# Altium schematic sheet Microprocessor1.SchDoc
size B; Organization: The Pennsylvania State University - Applied Research Laboratory; DocumentNumber: 9; SheetNumber: 9; SheetTotal: 14; PageSetup: Record=PageOptions|CenterHorizontal=True|CenterVertical=True|PrintScale=0.99|XCorrection=1.00|YCorrection=1.00|PrintKind=1|BorderSize=5000000|LeftOffset=0|BottomOffset=0|Orientation=2|PaperLength=1000|PaperWidth=1000|Scale=100|PaperSource=7|PrintQuality=-4|MediaType=1|DitherType=10|PaperKind=Tabloid (11 x 17")|PrintScaleMode=1; SCHEMATIC_SHEET_TITLE: LPC4357 P0-PA; PAGE_TITLE: -
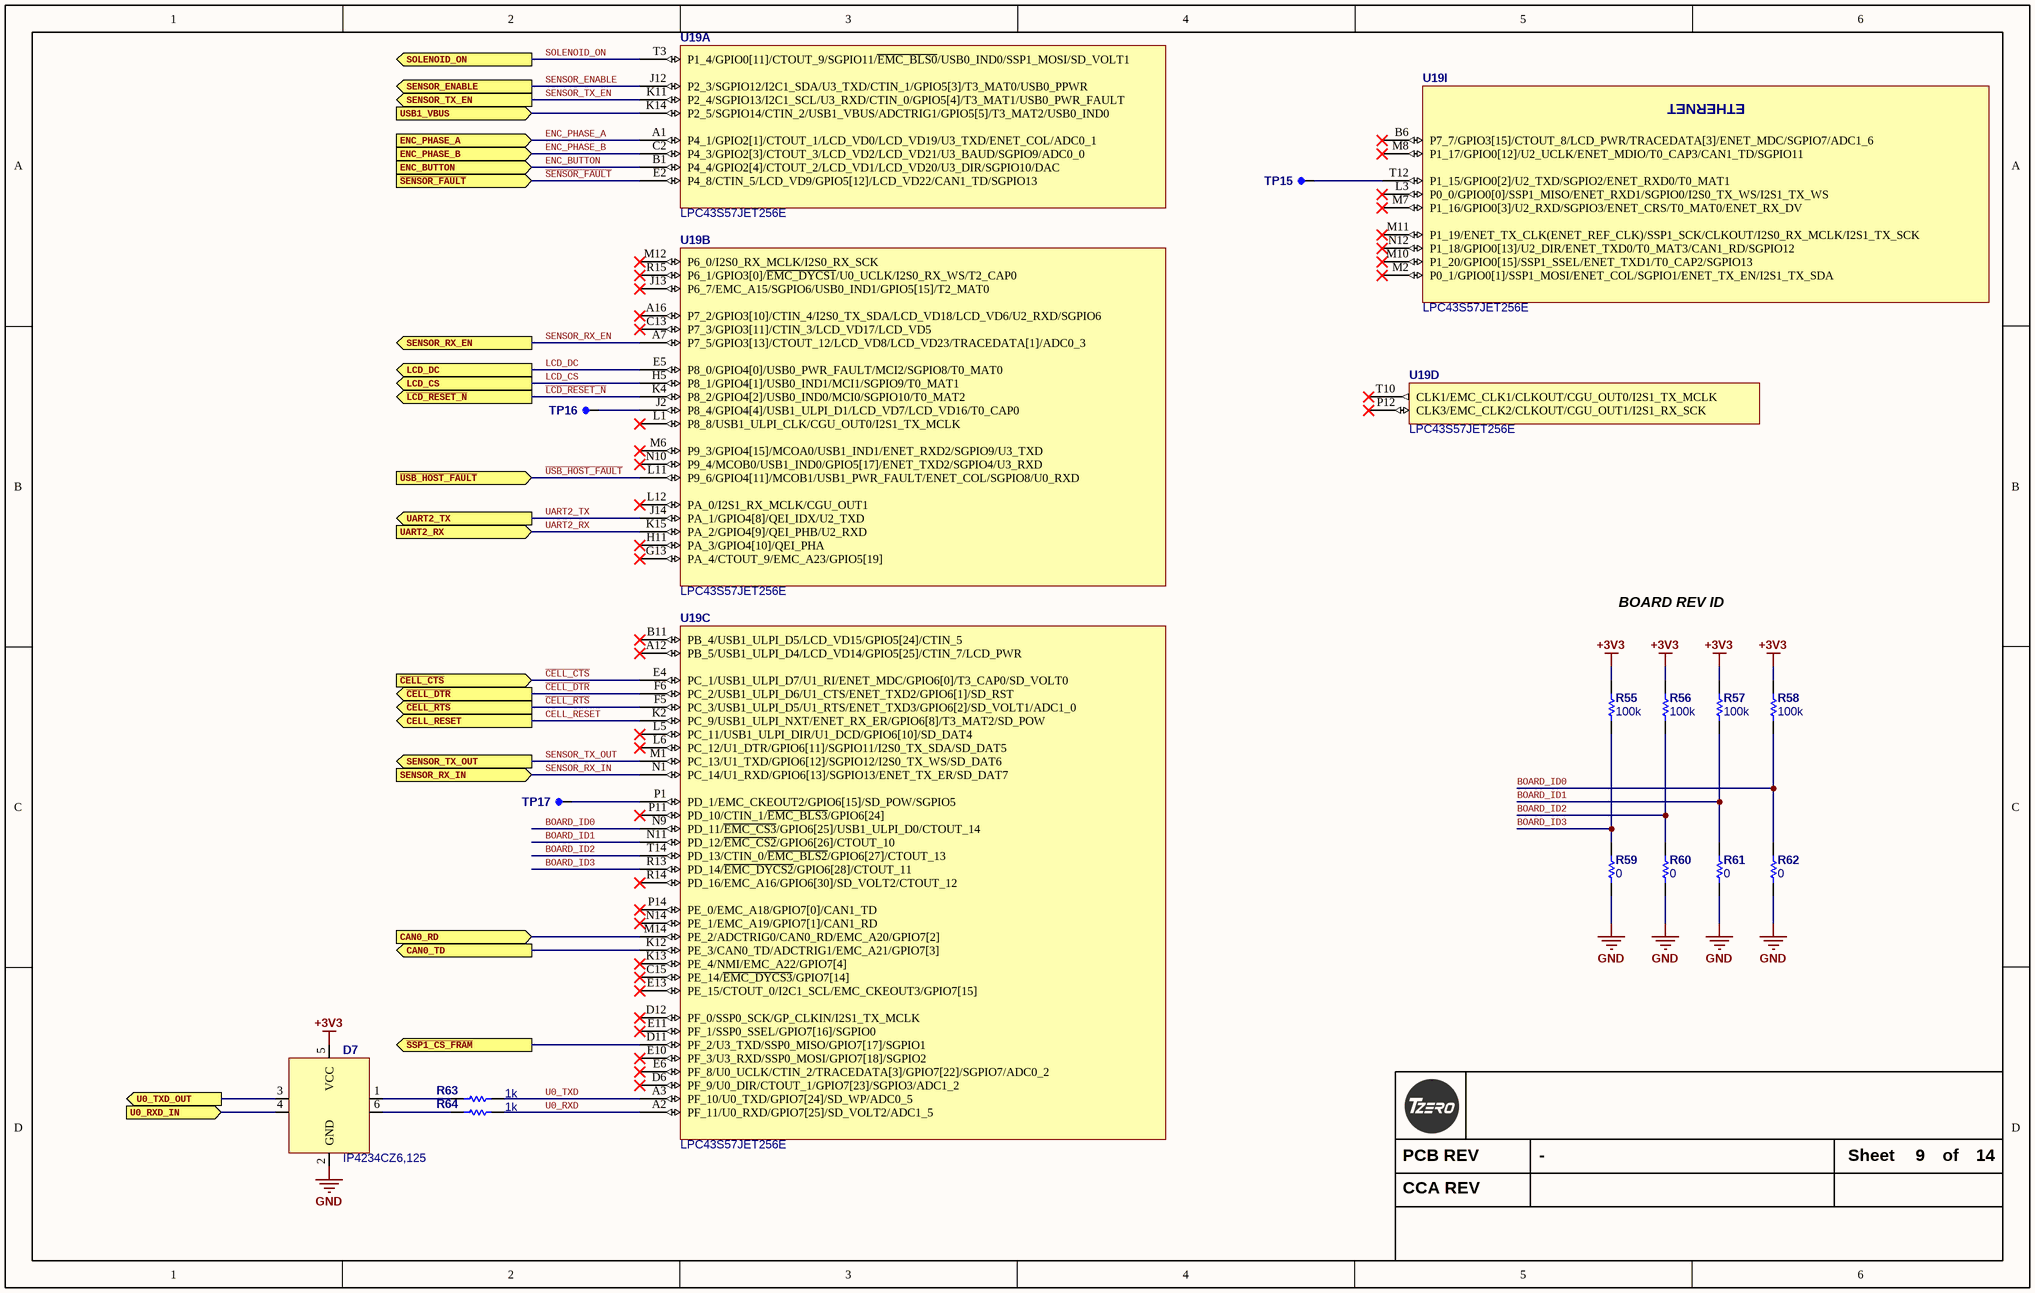
[diagram p0: Microprocessor1.SchDoc]

## Parts
D7  IP4234CZ6,125  [SOT427_MEDIUM]
R55  100k  [R0603_0.55MM_MD]
R56  100k  [R0603_0.55MM_MD]
R57  100k  [R0603_0.55MM_MD]
R58  100k  [R0603_0.55MM_MD]
R59  0  [R0603_0.55MM_MD]
R60  0  [R0603_0.55MM_MD]
R61  0  [R0603_0.55MM_MD]
R62  0  [R0603_0.55MM_MD]
R63  1k  [R0603_0.55MM_MD]
R64  1k  [R0603_0.55MM_MD]
TP15  (no value)  [TP_SMT_25_MIL_ROUND]  (net tie, no BOM)
TP16  (no value)  [TP_SMT_25_MIL_ROUND]  (net tie, no BOM)
TP17  (no value)  [TP_SMT_25_MIL_ROUND]  (net tie, no BOM)
U19  LPC43S57JET256E  [LBGA256 16X16 1700X1700X155]  (parts A,B,C,D,I of 10)

## Ports
CAN0_RD (in), CAN0_TD (out), CELL_RESET (out), ENC_BUTTON (in), ENC_PHASE_A (in), ENC_PHASE_B (in), LCD_CS (out), LCD_DC (out), SENSOR_ENABLE (out), SENSOR_RX_EN (out), SENSOR_RX_IN (in), SENSOR_TX_EN (out), SENSOR_TX_OUT (out), SOLENOID_ON (out), U0_RXD_IN (in), U0_TXD_OUT (out), UART2_RX (in), UART2_TX (out), USB1_VBUS (in), ~{CELL_CTS} (in), ~{CELL_DTR} (out), ~{CELL_RTS} (out), ~{LCD_RESET_N} (out), ~{SENSOR_FAULT} (in), ~{SSP1_CS_FRAM} (out), ~{USB_HOST_FAULT} (in)

## Nets
+3V3: D7.5(VCC) R55.1 R56.1 R57.1 R58.1
GND: D7.2(GND) R59.2 R60.2 R61.2 R62.2
~{CELL_CTS}: U19.E4(PC_1/USB1_ULPI_D7/U1_RI/ENET_MDC/GPIO6[0]/T3_CAP0/SD_VOLT0) ; port ~{CELL_CTS}
~{CELL_DTR}: U19.F6(PC_2/USB1_ULPI_D6/U1_CTS/ENET_TXD2/GPIO6[1]/SD_RST) ; port ~{CELL_DTR}
~{CELL_RTS}: U19.F5(PC_3/USB1_ULPI_D5/U1_RTS/ENET_TXD3/GPIO6[2]/SD_VOLT1/ADC1_0) ; port ~{CELL_RTS}
~{LCD_RESET_N}: U19.K4(P8_2/GPIO4[2]/USB0_IND0/MCI0/SGPIO10/T0_MAT2) ; port ~{LCD_RESET_N}
~{SENSOR_FAULT}: U19.E2(P4_8/CTIN_5/LCD_VD9/GPIO5[12]/LCD_VD22/CAN1_TD/SGPIO13) ; port ~{SENSOR_FAULT}
~{SSP1_CS_FRAM}: U19.D11(PF_2/U3_TXD/SSP0_MISO/GPIO7[17]/SGPIO1) ; port ~{SSP1_CS_FRAM}
~{USB_HOST_FAULT}: U19.L11(P9_6/GPIO4[11]/MCOB1/USB1_PWR_FAULT/ENET_COL/SGPIO8/U0_RXD) ; port ~{USB_HOST_FAULT}
BOARD_ID0: R58.2 R62.1 U19.N9(PD_11/~{EMC_CS3}/GPIO6[25]/USB1_ULPI_D0/CTOUT_14)
BOARD_ID1: R57.2 R61.1 U19.N11(PD_12/~{EMC_CS2}/GPIO6[26]/CTOUT_10)
BOARD_ID2: R56.2 R60.1 U19.T14(PD_13/CTIN_0/~{EMC_BLS2}/GPIO6[27]/CTOUT_13)
BOARD_ID3: R55.2 R59.1 U19.R13(PD_14/~{EMC_DYCS2}/GPIO6[28]/CTOUT_11)
CAN0_RD: U19.M14(PE_2/ADCTRIG0/CAN0_RD/EMC_A20/GPIO7[2]) ; port CAN0_RD
CAN0_TD: U19.K12(PE_3/CAN0_TD/ADCTRIG1/EMC_A21/GPIO7[3]) ; port CAN0_TD
CELL_RESET: U19.K2(PC_9/USB1_ULPI_NXT/ENET_RX_ER/GPIO6[8]/T3_MAT2/SD_POW) ; port CELL_RESET
ENC_BUTTON: U19.B1(P4_4/GPIO2[4]/CTOUT_2/LCD_VD1/LCD_VD20/U3_DIR/SGPIO10/DAC) ; port ENC_BUTTON
ENC_PHASE_A: U19.A1(P4_1/GPIO2[1]/CTOUT_1/LCD_VD0/LCD_VD19/U3_TXD/ENET_COL/ADC0_1) ; port ENC_PHASE_A
ENC_PHASE_B: U19.C2(P4_3/GPIO2[3]/CTOUT_3/LCD_VD2/LCD_VD21/U3_BAUD/SGPIO9/ADC0_0) ; port ENC_PHASE_B
LCD_CS: U19.H5(P8_1/GPIO4[1]/USB0_IND1/MCI1/SGPIO9/T0_MAT1) ; port LCD_CS
LCD_DC: U19.E5(P8_0/GPIO4[0]/USB0_PWR_FAULT/MCI2/SGPIO8/T0_MAT0) ; port LCD_DC
SENSOR_ENABLE: U19.J12(P2_3/SGPIO12/I2C1_SDA/U3_TXD/CTIN_1/GPIO5[3]/T3_MAT0/USB0_PPWR) ; port SENSOR_ENABLE
SENSOR_RX_EN: U19.A7(P7_5/GPIO3[13]/CTOUT_12/LCD_VD8/LCD_VD23/TRACEDATA[1]/ADC0_3) ; port SENSOR_RX_EN
SENSOR_RX_IN: U19.N1(PC_14/U1_RXD/GPIO6[13]/SGPIO13/ENET_TX_ER/SD_DAT7) ; port SENSOR_RX_IN
SENSOR_TX_EN: U19.K11(P2_4/SGPIO13/I2C1_SCL/U3_RXD/CTIN_0/GPIO5[4]/T3_MAT1/USB0_PWR_FAULT) ; port SENSOR_TX_EN
SENSOR_TX_OUT: U19.M1(PC_13/U1_TXD/GPIO6[12]/SGPIO12/I2S0_TX_WS/SD_DAT6) ; port SENSOR_TX_OUT
SOLENOID_ON: U19.T3(P1_4/GPIO0[11]/CTOUT_9/SGPIO11/~{EMC_BLS0}/USB0_IND0/SSP1_MOSI/SD_VOLT1) ; port SOLENOID_ON
U0_RXD: R64.2 U19.A2(PF_11/U0_RXD/GPIO7[25]/SD_VOLT2/ADC1_5)
U0_RXD_IN: D7.4 ; port U0_RXD_IN
U0_TXD: R63.2 U19.A3(PF_10/U0_TXD/GPIO7[24]/SD_WP/ADC0_5)
U0_TXD_OUT: D7.3 ; port U0_TXD_OUT
UART2_RX: U19.K15(PA_2/GPIO4[9]/QEI_PHB/U2_RXD) ; port UART2_RX
UART2_TX: U19.J14(PA_1/GPIO4[8]/QEI_IDX/U2_TXD) ; port UART2_TX
USB1_VBUS: U19.K14(P2_5/SGPIO14/CTIN_2/USB1_VBUS/ADCTRIG1/GPIO5[5]/T3_MAT2/USB0_IND0) ; port USB1_VBUS
NetD7_1: D7.1 R63.1
NetD7_6: D7.6 R64.1
NetTP15_1: TP15.1 U19.T12(P1_15/GPIO0[2]/U2_TXD/SGPIO2/ENET_RXD0/T0_MAT1)
NetTP16_1: TP16.1 U19.J2(P8_4/GPIO4[4]/USB1_ULPI_D1/LCD_VD7/LCD_VD16/T0_CAP0)
NetTP17_1: TP17.1 U19.P1(PD_1/EMC_CKEOUT2/GPIO6[15]/SD_POW/SGPIO5)

Not connected (* = marked no-connect by the designer): U19 A12(PB_5/USB1_ULPI_D4/LCD_VD14/GPIO5[25]/CTIN_7/LCD_PWR)* A16(P7_2/GPIO3[10]/CTIN_4/I2S0_TX_SDA/LCD_VD18/LCD_VD6/U2_RXD/SGPIO6)* B6(P7_7/GPIO3[15]/CTOUT_8/LCD_PWR/TRACEDATA[3]/ENET_MDC/SGPIO7/ADC1_6)* B11(PB_4/USB1_ULPI_D5/LCD_VD15/GPIO5[24]/CTIN_5)* C13(P7_3/GPIO3[11]/CTIN_3/LCD_VD17/LCD_VD5)* C15(PE_14/~{EMC_DYCS3}/GPIO7[14])* D6(PF_9/U0_DIR/CTOUT_1/GPIO7[23]/SGPIO3/ADC1_2)* D12(PF_0/SSP0_SCK/GP_CLKIN/I2S1_TX_MCLK)* E6(PF_8/U0_UCLK/CTIN_2/TRACEDATA[3]/GPIO7[22]/SGPIO7/ADC0_2)* E10(PF_3/U3_RXD/SSP0_MOSI/GPIO7[18]/SGPIO2)* E11(PF_1/SSP0_SSEL/GPIO7[16]/SGPIO0)* E13(PE_15/CTOUT_0/I2C1_SCL/EMC_CKEOUT3/GPIO7[15])* G13(PA_4/CTOUT_9/EMC_A23/GPIO5[19])* H11(PA_3/GPIO4[10]/QEI_PHA)* J13(P6_7/EMC_A15/SGPIO6/USB0_IND1/GPIO5[15]/T2_MAT0)* K13(PE_4/NMI/EMC_A22/GPIO7[4])* L1(P8_8/USB1_ULPI_CLK/CGU_OUT0/I2S1_TX_MCLK)* L3(P0_0/GPIO0[0]/SSP1_MISO/ENET_RXD1/SGPIO0/I2S0_TX_WS/I2S1_TX_WS)* L5(PC_11/USB1_ULPI_DIR/U1_DCD/GPIO6[10]/SD_DAT4)* L6(PC_12/U1_DTR/GPIO6[11]/SGPIO11/I2S0_TX_SDA/SD_DAT5)* L12(PA_0/I2S1_RX_MCLK/CGU_OUT1)* M2(P0_1/GPIO0[1]/SSP1_MOSI/ENET_COL/SGPIO1/ENET_TX_EN/I2S1_TX_SDA)* M6(P9_3/GPIO4[15]/MCOA0/USB1_IND1/ENET_RXD2/SGPIO9/U3_TXD)* M7(P1_16/GPIO0[3]/U2_RXD/SGPIO3/ENET_CRS/T0_MAT0/ENET_RX_DV)* M8(P1_17/GPIO0[12]/U2_UCLK/ENET_MDIO/T0_CAP3/CAN1_TD/SGPIO11)* M10(P1_20/GPIO0[15]/SSP1_SSEL/ENET_TXD1/T0_CAP2/SGPIO13)* M11(P1_19/ENET_TX_CLK(ENET_REF_CLK)/SSP1_SCK/CLKOUT/I2S0_RX_MCLK/I2S1_TX_SCK)* M12(P6_0/I2S0_RX_MCLK/I2S0_RX_SCK)* N10(P9_4/MCOB0/USB1_IND0/GPIO5[17]/ENET_TXD2/SGPIO4/U3_RXD)* N12(P1_18/GPIO0[13]/U2_DIR/ENET_TXD0/T0_MAT3/CAN1_RD/SGPIO12)* N14(PE_1/EMC_A19/GPIO7[1]/CAN1_RD)* P11(PD_10/CTIN_1/~{EMC_BLS3}/GPIO6[24])* P12(CLK3/EMC_CLK2/CLKOUT/CGU_OUT1/I2S1_RX_SCK)* P14(PE_0/EMC_A18/GPIO7[0]/CAN1_TD)* R14(PD_16/EMC_A16/GPIO6[30]/SD_VOLT2/CTOUT_12)* R15(P6_1/GPIO3[0]/~{EMC_DYCS1}/U0_UCLK/I2S0_RX_WS/T2_CAP0)* T10(CLK1/EMC_CLK1/CLKOUT/CGU_OUT0/I2S1_TX_MCLK)*

## Notes on the sheet
- BOARD REV ID
- PCB REV
- Sheet
- of
- CCA REV
- (in symbol LPC43S57JET256E, part I) ETHERNET

## Library data of the parts
D7 = IP4234CZ6,125: IC USB2.0 ESD PROTECTION SOT457; Manufacturer: NXP Semiconductors; CategorySort: 400; Voltage - Reverse Standoff (Typ): 3V; Voltage - Breakdown: 6V; Power (Watts): 100W; Polarization: 2 Channel Array - Bidirectional; Value: IP4234CZ6,125; Sort Value: *; Category: Diodes; Supplier 1: Digi-Key; Supplier Part Number 1: 568-5869-1-ND; Manufacturer Part Number: IP4234CZ6,125; RoHS: RoHS Compliant; Stock 1: 5142; Pricing 1: 1=0.52, 10=0.418, 25=0.3656, 100=0.3135, 250=0.27076, 500=0.23276, 1000=0.1805 (USD); Mounting Type: Surface Mount; Package: SC-74, SOT-457; Supplier Device Package: 6-TSOP; Packaging: Cut Tape (CT); ComponentLink1URL: http://www.nxp.com/documents/data_sheet/IP4234CZ6.pdf; ComponentLink1Description: http://www.nxp.com/documents/data_sheet/IP4234CZ6.pdf; Manufacturer 1: NXP Semiconductors; Manufacturer Part Number 1: IP4234CZ6,125
R55-R58 = ERJ-3EKF1003V: RES 100K OHM 1/10W 1% 0603 SMD; Manufacturer: Panasonic Electronic Components; Package Power: 0603  (0.1W); Power (Watts): 0.1W- 1/10W; Temperature Coefficient: ±100ppm/°C; Limiting Element Voltage: 75; Maximum Overload Voltage: 150; Maximum Working Voltage: 75.0V; Substitution Notes: 100k , ±1% , 0603 , AEC-Q200; Value: 100k; Manufacturer Part Number: ERJ-3EKF1003V; ComponentLink1Description: Internal Datasheet; ComponentLink1URL: datasheets\Panasonic Electronic Components\AOA0000CE2.pdf; ComponentLink2Description: External Datasheet; ComponentLink2URL: http://industrial.panasonic.com/www-data/pdf/AOA0000/AOA0000CE2.pdf; Supplier 1: Digi-Key; Supplier Part Number 1: P100KHCT-ND; Category: Resistors; Resistance (Ohms): 100k; Composition: Thick Film; Features: -; Tolerance: ±1%; Package: 0603 (1608 Metric); Supplier Package: 0603; Size / Dimension: 0.063" L x 0.031" W (1.60mm x 0.80mm); Height: 0.55MM; Number of Terminations: 2; Packaging: Cut Tape (CT); Sort Value: 100000; Sort Value Package: 603_100000; Ratings: AEC-Q200
R59-R62 = ERJ-3GEY0R00V: RES 0.0 OHM 1/10W JUMP 0603 SMD; Manufacturer: Panasonic Electronic Components; Power (Watts): 0.1W- 1/10W; Tolerance: Jumper; Package Power: 0603  (0.1W); Limiting Element Voltage: 75; Maximum Overload Voltage: 150; Maximum Working Voltage: 0.0V; Substitution Notes: 0 , Jumper , 0603 , AEC-Q200; Value: 0; Supplier 1: Digi-Key; Supplier Part Number 1: P0.0GCT-ND; Manufacturer Part Number: ERJ-3GEY0R00V; Category: Resistors; Sort Value: 0; Composition: Thick Film; Features: -; Temperature Coefficient: -; Package: 0603 (1608 Metric); Size / Dimension: 0.063" L x 0.031" W (1.60mm x 0.80mm); Height: 0.55MM; ComponentLink1URL: datasheets\Panasonic Electronic Components\AOA0000CE1.pdf; ComponentLink1Description: Internal Datasheet; ComponentLink2Description: External Datasheet; ComponentLink2URL: http://industrial.panasonic.com/www-data/pdf/AOA0000/AOA0000CE1.pdf; Resistance (Ohms): 0; Supplier Package: 0603; Number of Terminations: 2; Sort Value Package: 603_0; Ratings: AEC-Q200
R63 R64 = ERJ-3EKF1001V: RES 1K OHM 1/10W 1% 0603 SMD; Manufacturer: Panasonic Electronic Components; Package Power: 0603  (0.1W); Power (Watts): 0.1W- 1/10W; Temperature Coefficient: ±100ppm/°C; Limiting Element Voltage: 75; Maximum Overload Voltage: 150; Maximum Working Voltage: 10.0V; Substitution Notes: 1k , ±1% , 0603 , AEC-Q200; Value: 1k; Manufacturer Part Number: ERJ-3EKF1001V; ComponentLink1Description: Internal Datasheet; ComponentLink1URL: datasheets\Panasonic Electronic Components\AOA0000CE2.pdf; ComponentLink2Description: External Datasheet; ComponentLink2URL: http://industrial.panasonic.com/www-data/pdf/AOA0000/AOA0000CE2.pdf; Supplier 1: Digi-Key; Supplier Part Number 1: P1.00KHCT-ND; Category: Resistors; Resistance (Ohms): 1k; Composition: Thick Film; Features: -; Tolerance: ±1%; Package: 0603 (1608 Metric); Supplier Package: 0603; Size / Dimension: 0.063" L x 0.031" W (1.60mm x 0.80mm); Height: 0.55MM; Number of Terminations: 2; Packaging: Cut Tape (CT); Sort Value: 1000; Sort Value Package: 603_1000; Ratings: AEC-Q200
TP15-TP17 = TP SMT 25MIL: Sort Value: *; Category: *; CategorySort: *
U19 = LPC43S57JET256E: ARM Microcontrollers - MCU CortexM0/4 32bit 1MB Cortex-M4/M0; Manufacturer: NXP Semiconductors; CategorySort: 600; Data RAM Size: 136 KB; Core: ARM Cortex M4/M0; Maximum Clock Frequency: 204 MHz; On-Chip ADC: Yes; Operating Supply Voltage: 2.2 V to 3.6 V; Processor Series: LPC4357; Product Status: New Technology; Value: LPC43S57JET256E; Sort Value: *; Category: Integrated Circuits; Supplier 1: Digi-Key; Supplier Part Number 1: 568-11712-ND; Manufacturer Part Number: LPC43S57JET256E; RoHS: RoHS Compliant; Stock 1: 108; Pricing 1: 1=14.40, 25=13.31, 100=12.24, 250=11.16, 500=10.43, 1000=9.57 (USD); Package: LBGA-256; Packaging: Tray; Mounting Style: SMD/SMT; Program Memory Size: 1 MB; Data Bus Width: 32 bit; Maximum Operating Temperature: + 85 C; Minimum Operating Temperature: - 40 C; Standard Pack Qty: 90; Tradename: LPC; RoHS - Mouser: Y; Minimum Order Quantity: 1; Reeling: False; ComponentLink1URL: http://www.nxp.com/documents/data_sheet/LPC4357_53_37_33.pdf; ComponentLink1Description: http://www.nxp.com/documents/data_sheet/LPC4357_53_37_33.pdf